# Altium schematic sheet SENSING.SchDoc: SENSING
size A3; DocumentNumber: 6; SheetNumber: 6; SheetTotal: 6
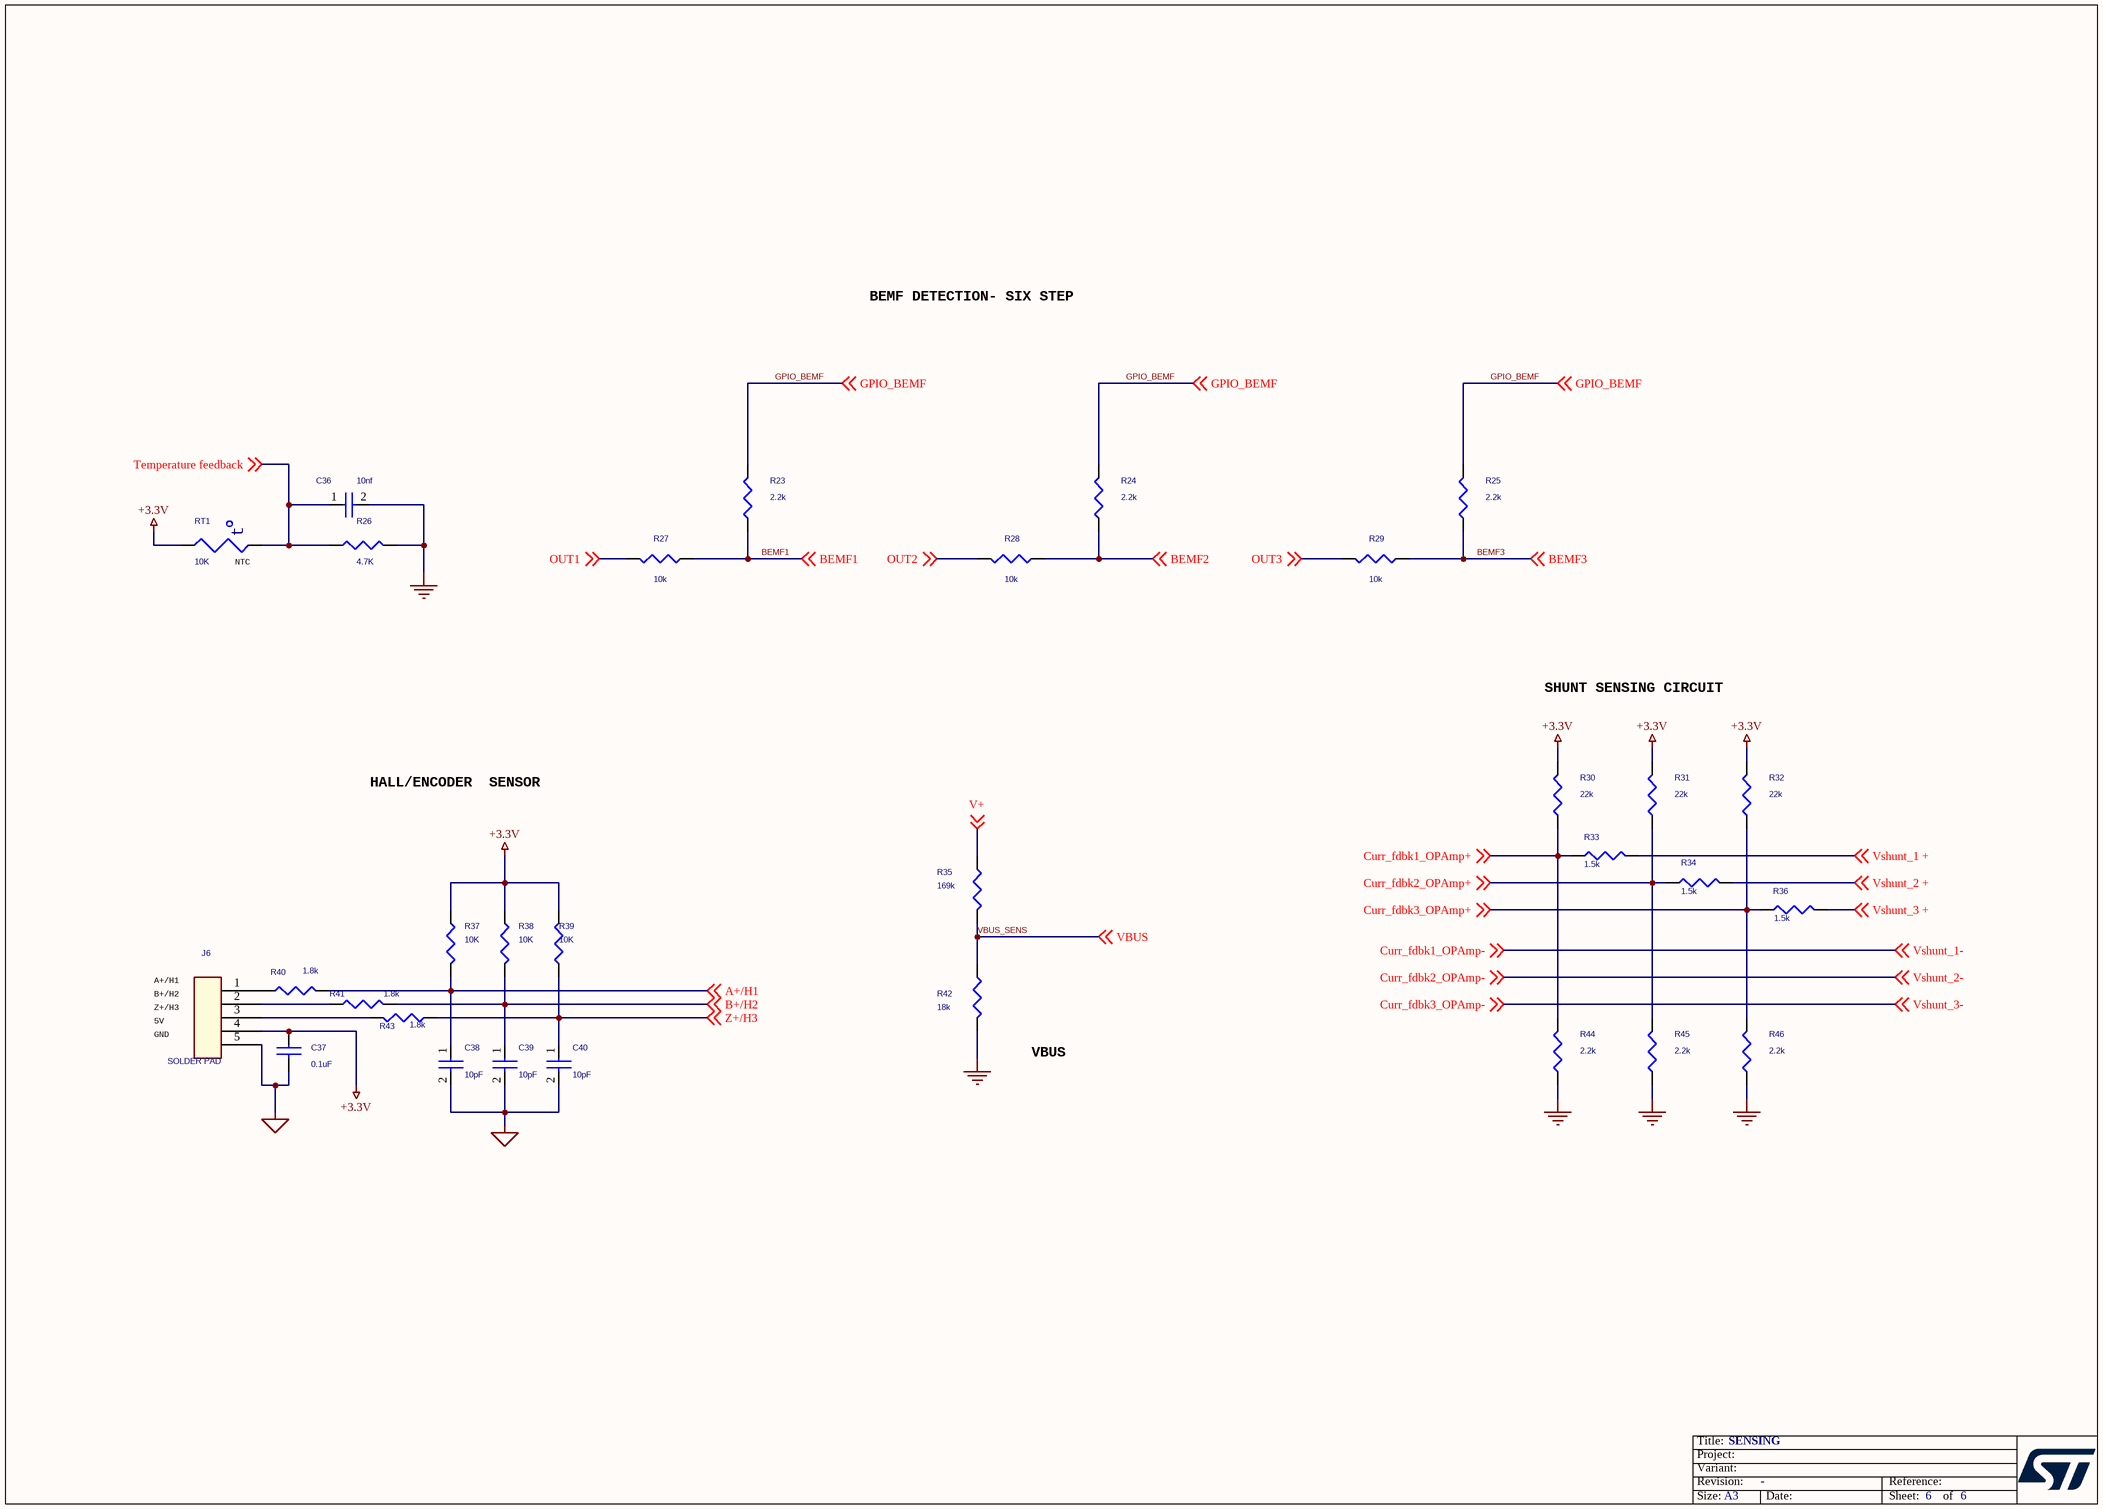
[diagram p0: SENSING.SchDoc]

## Parts
C36  10nf  [C_0402]
C37  0.1uF  [C_0402]
C38  10pF  [C_0402]
C39  10pF  [C_0402]
C40  10pF  [C_0402]
J6  SOLDER PAD  [SOLDER_PAD_5PIN_SMD]
R23  2.2k  [R_0402]
R24  2.2k  [R_0402]
R25  2.2k  [R_0402]
R26  4.7K  [R_0402]
R27  10k  [R_0402]
R28  10k  [R_0402]
R29  10k  [R_0402]
R30  22k  [r_0402]
R31  22k  [r_0402]
R32  22k  [r_0402]
R33  1.5k  [R_0402]
R34  1.5k  [R_0402]
R35  169k  [R_0402]
R36  1.5k  [R_0402]
R37  10K  [R_0402]
R38  10K  [R_0402]
R39  10K  [R_0402]
R40  1.8k  [R_0402]
R41  1.8k  [R_0402]
R42  18k  [R_0402]
R43  1.8k  [R_0402]
R44  2.2k  [R_0402]
R45  2.2k  [R_0402]
R46  2.2k  [R_0402]
RT1  10K  [R_0402]

## Nets
+3.3V: C37.1 J6.4 R30.2 R31.2 R32.2 R37.1 R38.1 R39.2 RT1.1
GND: C36.2 R26.2 R42.2 R44.1 R45.1 R46.1
GND_SIGNAL: C37.2 C38.2 C39.2 C40.2 J6.5
A+/H1: C38.1 R37.2 R40.2 ; off-sheet A+/H1
B+/H2: C39.1 R38.2 R41.2 ; off-sheet B+/H2
BEMF1: R23.1 R27.1 ; off-sheet BEMF1
BEMF2: R24.1 R28.1 ; off-sheet BEMF2
BEMF3: R25.1 R29.1 ; off-sheet BEMF3
Curr_fdbk1_OPAmp+: R30.1 R33.1 R44.2 ; off-sheet Curr_fdbk1_OPAmp+
Curr_fdbk1_OPAmp-: off-sheet Curr_fdbk1_OPAmp-, off-sheet Vshunt_1-  [also labelled Vshunt_1-]
Curr_fdbk2_OPAmp+: R31.1 R34.1 R45.2 ; off-sheet Curr_fdbk2_OPAmp+
Curr_fdbk2_OPAmp-: off-sheet Curr_fdbk2_OPAmp-, off-sheet Vshunt_2-  [also labelled Vshunt_2-]
Curr_fdbk3_OPAmp+: R32.1 R36.1 R46.2 ; off-sheet Curr_fdbk3_OPAmp+
Curr_fdbk3_OPAmp-: off-sheet Curr_fdbk3_OPAmp-, off-sheet Vshunt_3-  [also labelled Vshunt_3-]
GPIO_BEMF: R23.2 R24.2 R25.2 ; off-sheet GPIO_BEMF
OUT1: R27.2 ; off-sheet OUT1
OUT2: R28.2 ; off-sheet OUT2
OUT3: R29.2 ; off-sheet OUT3
Temperature feedback: C36.1 R26.1 RT1.2 ; off-sheet Temperature feedback
V+: R35.1 ; off-sheet V+
VBUS_SENS: R35.2 R42.1 ; off-sheet VBUS  [also labelled VBUS]
Vshunt_1 +: R33.2 ; off-sheet Vshunt_1 +
Vshunt_2 +: R34.2 ; off-sheet Vshunt_2 +
Vshunt_3 +: R36.2 ; off-sheet Vshunt_3 +
Z+/H3: C40.1 R39.1 R43.1 ; off-sheet Z+/H3
NetJ6_1: J6.1 R40.1
NetJ6_2: J6.2 R41.1
NetJ6_3: J6.3 R43.2

## Notes on the sheet
- BEMF DETECTION- SIX STEP
- (near RT1) NTC
- SHUNT SENSING CIRCUIT
- HALL/ENCODER  SENSOR
- (near J6) A+/H1
- 5V
- (near J6) Z+/H3
- (near J6) B+/H2
- GND
- VBUS
- Title:
- Project:
- Size:
- Revision:
- Variant:
- A3
- -
- Date:
- Reference:
- Sheet:
- of
- (in symbol NTC) t

## Library data of the parts
C36 = CAP_Dup1: CAP CER 10000PF 10V X7R 0402; PART_NUMBER: CAP-00000003; Manufacturer: Wurth Electronics Inc.; Manufacturer PN: 885012205012; Dielectric Type: Capacitors; Tolerance: 10%; CLASS: DISCRETE; Package Size: 0402 (1005 Metric); Temperature Coefficient: X7R; Rated Voltage: 10V
C37 = CAP_4: CAP CER 0.1UF 16V X7R 0402; Manufacturer PN: 885012205037; Manufacturer: Wurth Electronics Inc.; PART_NUMBER: CAP-00000053; CLASS: DISCRETE; Tolerance: 10%; Dielectric Type: Capacitors; Rated Voltage: 16V; Temperature Coefficient: X7R; Package Size: 0402 (1005 Metric)
C38-C40 = CAP: CAP CER 10PF 10V C0G/NP0 0402; Manufacturer PN: 885012005007; Manufacturer: Wurth Electronics Inc.; PART_NUMBER: TMP-395; CLASS: DISCRETE; Tolerance: 5%; Temperature Coefficient: C0G, NP0; Dielectric Type: Capacitors; Rated Voltage: 10V; Package Size: 0402 (1005 Metric)
J6 = CON5: SOLDER PADS
R23-R25 R27-R29 = RES: RES SMD 2.2K OHM 1% 1/16W 0402; Manufacturer PN: RC0402FR-072K2L; Manufacturer: Yageo; PART_NUMBER: TMP-444; CLASS: DISCRETE; Rated Power: 0.063W, 1/16W; Temperature Coefficient: 100ppm/C; Tolerance: 1%; Package Size: 0402 (1005 Metric)
R26 = RES: RES SMD 4.7K OHM 1% 1/16W 0402; PART_NUMBER: TMP-403; Manufacturer: TE Connectivity Passive Product; Manufacturer PN: CRG0402F4K7; Temperature Coefficient: 100ppm/C; Rated Power: 0.063W, 1/16W; CLASS: DISCRETE; Package Size: 0402 (1005 Metric); Tolerance: 1%
R30-R32 = RES: RES SMD 22K OHM 1% 1/10W 0402; PART_NUMBER: TMP-751; Manufacturer: Panasonic Electronic Components; Manufacturer PN: ERJ-2RKF2202X; Temperature Coefficient: 100ppm/C; Rated Power: 0.1W, 1/10W; CLASS: DISCRETE; Package Size: 0402 (1005 Metric); Tolerance: 1%
R33 R34 R36 = RES: RES SMD 1.5K OHM 1% 1/16W 0402; PART_NUMBER: TMP-393; Manufacturer: Yageo; Manufacturer PN: RC0402FR-071K5L; Temperature Coefficient: 100ppm/C; Rated Power: 0.063W, 1/16W; CLASS: DISCRETE; Package Size: 0402 (1005 Metric); Tolerance: 1%
R35 = RES: RES SMD 169K OHM 1% 1/16W 0402; PART_NUMBER: TMP-424; Manufacturer: Yageo; Manufacturer PN: RC0402FR-07169KL; Temperature Coefficient: 100ppm/C; Rated Power: 0.063W, 1/16W; CLASS: DISCRETE; Package Size: 0402 (1005 Metric); Tolerance: 1%
R37 = RES: RES SMD 10K OHM 1% 1/16W 0402; PART_NUMBER: TMP-396; Manufacturer: Yageo; Manufacturer PN: RC0402FR-0710KL; Temperature Coefficient: 100ppm/C; Rated Power: 0.063W, 1/16W; CLASS: DISCRETE; Package Size: 0402 (1005 Metric); Tolerance: 1%
R38 R39 = RES: RES SMD 10K OHM 1% 1/16W 0402; Manufacturer PN: RC0402FR-0710KL; Manufacturer: Yageo; PART_NUMBER: TMP-396; CLASS: DISCRETE; Rated Power: 0.063W, 1/16W; Temperature Coefficient: 100ppm/C; Tolerance: 1%; Package Size: 0402 (1005 Metric)
R40 = RES: RES SMD 1.8K OHM 1% 1/16W 0402; Manufacturer PN: RC0402FR-071K8L; Manufacturer: Yageo; PART_NUMBER: TMP-394; CLASS: DISCRETE; Rated Power: 0.063W, 1/16W; Temperature Coefficient: 100ppm/C; Tolerance: 1%; Package Size: 0402 (1005 Metric)
R41 R43 = RES: RES SMD 1.8K OHM 1% 1/16W 0402; PART_NUMBER: TMP-394; Manufacturer: Yageo; Manufacturer PN: RC0402FR-071K8L; Temperature Coefficient: 100ppm/C; Rated Power: 0.063W, 1/16W; CLASS: DISCRETE; Package Size: 0402 (1005 Metric); Tolerance: 1%
R42 = RES: RES SMD 18K OHM 1% 1/16W 0402; PART_NUMBER: TMP-425; Manufacturer: Yageo; Manufacturer PN: RC0402FR-0718KL; Temperature Coefficient: 100ppm/C; Rated Power: 0.063W, 1/16W; CLASS: DISCRETE; Package Size: 0402 (1005 Metric); Tolerance: 1%
R44-R46 = RES: RES SMD 2.2K OHM 1% 1/16W 0402; PART_NUMBER: TMP-444; Manufacturer: Yageo; Manufacturer PN: RC0402FR-072K2L; Temperature Coefficient: 100ppm/C; Rated Power: 0.063W, 1/16W; CLASS: DISCRETE; Package Size: 0402 (1005 Metric); Tolerance: 1%
RT1 = NTC: NTC THERMISTOR 10K OHM 1% 0402; Manufacturer PN: NTCG103JF103FT1; Manufacturer: TDK Corporation; PART_NUMBER: TMP-423; CLASS: DISCRETE; Package Size: 0402 (1005 Metric)